# Altium project Flower.PrjPcb
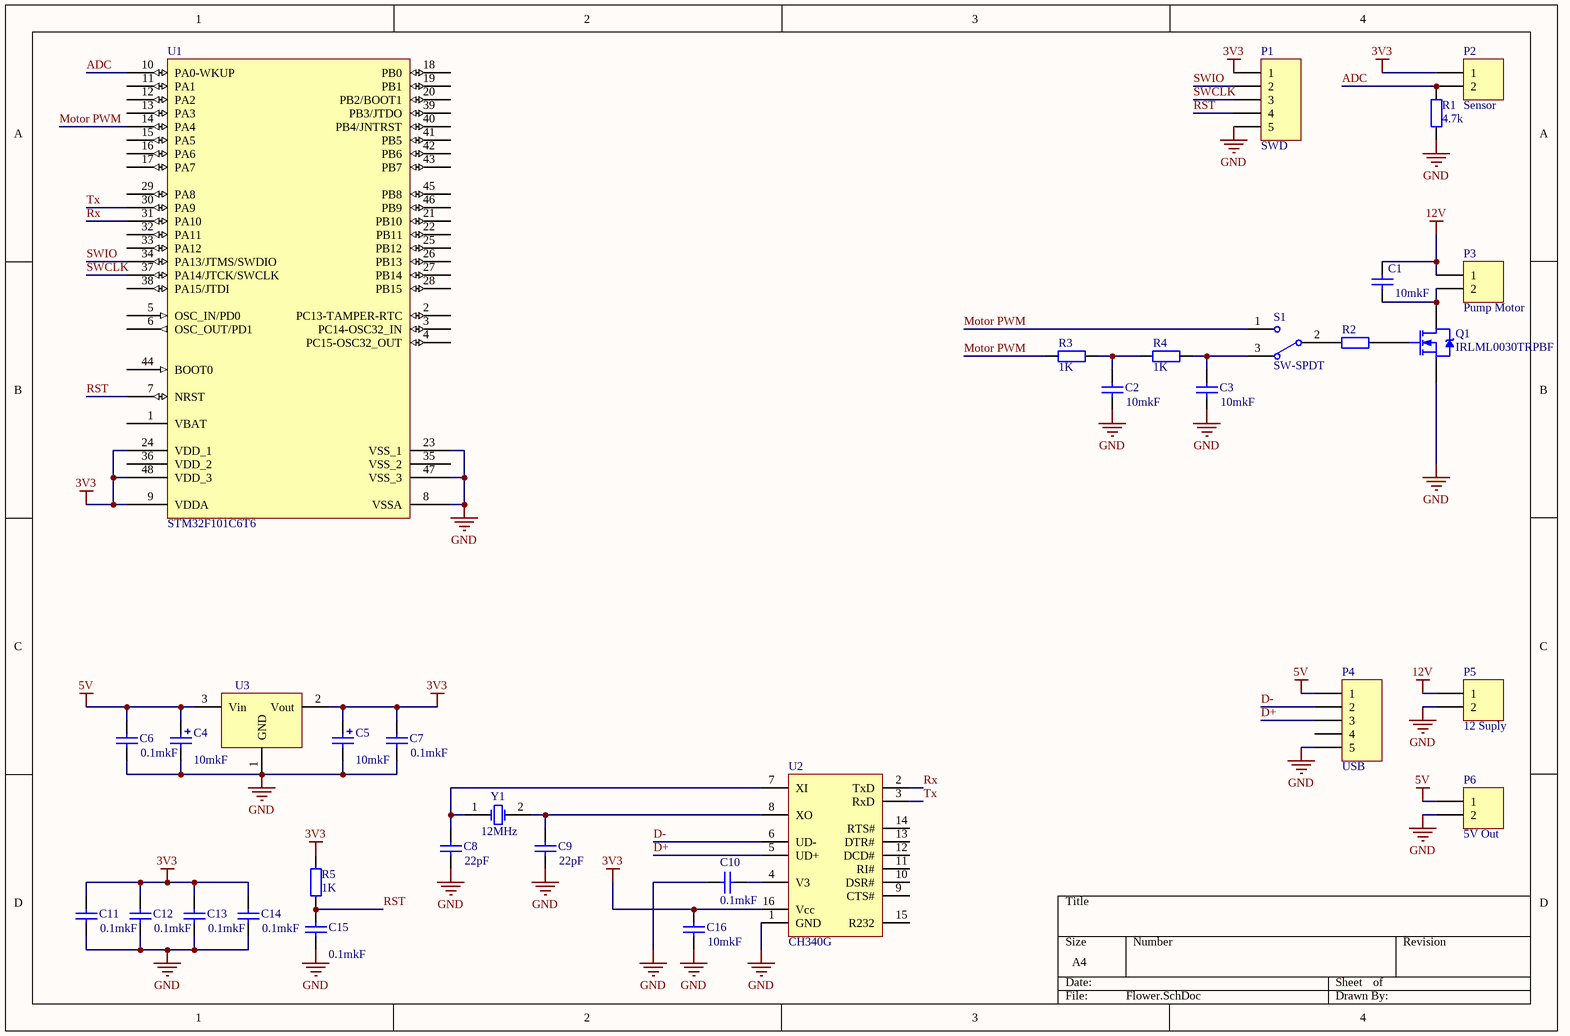
[diagram p0: Flower.SchDoc]
1 sheet, 33 parts. Net scope: global (net labels, ports and power ports of the same name join across sheets).
Board file: Flower.PcbDoc

## Sheet Flower.SchDoc
size A4

### Parts
C1  10mkF  [CAPC2012X135N]
C2  10mkF  [CAPC2012X135N]
C3  10mkF  [CAPC2012X135N]
C4  10mkF  [CAPC2012X135N]
C5  10mkF  [CAPC2012X135N]
C6  0.1mkF  [CAPC1608X90N]
C7  0.1mkF  [CAPC1608X90N]
C8  22pF  [CAPC1608X90N]
C9  22pF  [CAPC1608X90N]
C10  0.1mkF  [CAPC1608X90N]
C11  0.1mkF  [CAPC1608X90N]
C12  0.1mkF  [CAPC1608X90N]
C13  0.1mkF  [CAPC1608X90N]
C14  0.1mkF  [CAPC1608X90N]
C15  0.1mkF  [CAPC1608X90N]
C16  10mkF  [CAPC1608X90N]
P1  SWD  [HDR1X5]
P2  Sensor  [NXW-02SMDK]
P3  Pump Motor  [NXW-02SMDK]
P4  USB  [USB_Mini-B_Molex_SMT]
P5  12 Suply  [NXW-02SMD]
P6  5V Out  [NXW-02SMD]
Q1  IRLML0030TRPBF  [SOT23-3]
R1  4.7k  [RESC1608X55N]
R2  1K  [RESC1608X55N]  (value not drawn)
R3  1K  [RESC1608X55N]
R4  1K  [RESC1608X55N]
R5  1K  [RESC1608X55N]
S1  SW-SPDT  [HDR1X3]
U1  STM32F101C6T6  [LQFP48_N]
U2  CH340G  [SOIC127P600X175-16AN]
U3  LD1117  [SOT223]  (value not drawn)
Y1  value 12MHz  [KX-X 8MHz]  (hidden comment: XTAL)

### Nets
3V3: C5.1 C7.2 C11.2 C12.2 C13.2 C14.2 C16.2 P1.1 P2.1 R5.2 U1.9(VDDA) U1.24(VDD_1) U1.48(VDD_3) U2.16(Vcc) U3.2(Vout)
5V: C4.1 C6.2 P4.1 P6.1 U3.3(Vin)
12V: C1.2 P3.1 P5.1
GND: C2.1 C3.1 C4.2 C5.2 C6.1 C7.1 C8.1 C9.1 C10.2 C11.1 C12.1 C13.1 C14.1 C15.1 C16.1 P1.5 P4.5 P5.2 P6.2 Q1.3(S) R1.1 U1.8(VSSA) U1.23(VSS_1) U1.47(VSS_3) U2.1(GND) U3.1(GND)
ADC: P2.2 R1.2 U1.10(PA0-WKUP)
D+: P4.3 U2.5(UD+)
D-: P4.2 U2.6(UD-)
Motor PWM: R3.1 S1.1 U1.14(PA4)
RST: C15.2 P1.4 R5.1 U1.7(NRST)
Rx: U1.31(PA10) U2.2(TxD)
SWCLK: P1.3 U1.37(PA14/JTCK/SWCLK)
SWIO: P1.2 U1.34(PA13/JTMS/SWDIO)
Tx: U1.30(PA9) U2.3(RxD)
NetC1_1: C1.1 P3.2 Q1.2(D)
NetC2_2: C2.2 R3.2 R4.1
NetC3_2: C3.2 R4.2 S1.3
NetC8_2: C8.2 U2.7(XI) Y1.1(OSC1)
NetC9_2: C9.2 U2.8(XO) Y1.2(OSC2)
NetC10_1: C10.1 U2.4(V3)
NetQ1_1: Q1.1(G) R2.2
NetR2_1: R2.1 S1.2

Not connected (* = marked no-connect by the designer): P4 4; U1 1(VBAT) 2(PC13-TAMPER-RTC) 3(PC14-OSC32_IN) 4(PC15-OSC32_OUT) 5(OSC_IN/PD0) 6(OSC_OUT/PD1) 11(PA1) 12(PA2) 13(PA3) 15(PA5) 16(PA6) 17(PA7) 18(PB0) 19(PB1) 20(PB2/BOOT1) 21(PB10) 22(PB11) 25(PB12) 26(PB13) 27(PB14) 28(PB15) 29(PA8) 32(PA11) 33(PA12) 35(VSS_2) 36(VDD_2) 38(PA15/JTDI) 39(PB3/JTDO) 40(PB4/JNTRST) 41(PB5) 42(PB6) 43(PB7) 44(BOOT0) 45(PB8) 46(PB9); U2 9(CTS#) 10(DSR#) 11(RI#) 12(DCD#) 13(DTR#) 14(RTS#) 15(R232)

### Library data of the parts
C1-C3 C6-C16 = Cap Semi: Capacitor (Semiconductor SIM Model); Published: 8-Jun-2000; LatestRevisionDate: 29-May-2009; LatestRevisionNote: IPC-7351 Footprint Added.; PackageReference: C1206; Publisher: Altium Limited; PackageDescription: Chip Capacitor
  C1-C3 C16: Value: 10mkF
  C6 C7 C10-C15: Value: 0.1mkF
  C8 C9: Value: 22pF
C4 C5 = Cap Pol2: Polarized Capacitor (Axial); Published: 8-Jun-2000; LatestRevisionDate: 17-Jul-2002; LatestRevisionNote: Re-released for DXP Platform.; PackageReference: POLAR0.8; Publisher: Altium Limited; PackageDescription: Polarized Capacitor; 2 Leads; Value: 10mkF
P1 P4 = Header 5: Header, 5-Pin; LatestRevisionDate: 17-Jul-2002; LatestRevisionNote: Re-released for DXP Platform.; Publisher: Altium Limited
P2 P3 P5 P6 = Header 2: Header, 2-Pin; LatestRevisionDate: 17-Jul-2002; LatestRevisionNote: Re-released for DXP Platform.; Publisher: Altium Limited
Q1 = NMOS-2: N-Channel Power MOSFET; Note: Pin 2 is electrically connected to pin 4.; Published: 8-Jun-2000; LatestRevisionDate: 17-Jul-2002; LatestRevisionNote: Re-released for DXP Platform.; DatasheetVersion: PD-9.814; PackageVersion: Feb-1997; PackageReference: TO-220AB; Publisher: Altium Limited; PackageDescription: TO, Thru-Hole, Vertical, Heatsink Mounted; 3 In-Line Leads; Pitch 2.54 mm; ComponentLink1Description: Manufacturer Link; ComponentLink1URL: http://www.irf.com/
R1-R5 = Res2: Resistor; Published: 8-Jun-2000; LatestRevisionDate: 17-Jul-2002; LatestRevisionNote: Re-released for DXP Platform.; PackageReference: AXIAL-0.4; Publisher: Altium Limited; PackageDescription: Axial Device, Thru-Hole; 2 Leads; 0.4 in Pin Spacing
  R1: Value: 4.7k
  R2-R5: Value: 1K
S1 = SW-SPDT: SPDT Subminiature Toggle Switch, Right Angle Mounting, Vertical Actuation; Published: 24-Mar-1999; LatestRevisionDate: 17-Dec-2003; LatestRevisionNote: Schematic revised, PCB Footprint replaced.; DatasheetVersion: 05-Dec-2000; PackageReference: TL36WW15050; Publisher: Altium Limited; PackageDescription: Switch; 4 Leads; ComponentLink1Description: Manufacturer Link; ComponentLink1URL: http://www.apem.com
U1 = STM32F101C6T6: STM32 ARM-based 32-bit MCU with 32 Kbytes Flash, 48-pin LQFP, Industrial Temperature; Published: 30-May-2008; DatasheetVersion: rev6, Mar-2008; PackageVersion: Mar-2008; PackageReference: LQFP48; Publisher: Altium Limited; PackageDescription: 48-Pin Low-Profile Quad Flat Pack, 7 x 7 mm Body, 0.5 mm Pitch (LQFP48); ComponentLink1Description: Manufacturer Link; ComponentLink1URL: www.st.com/stm32; ComponentLink2Description: Datasheet; ComponentLink2URL: http://www.st.com/stonline/products/literature/ds/13586.pdf
Y1 = XTAL: Crystal Oscillator; Published: 8-Jun-2000; LatestRevisionDate: 17-Jul-2002; LatestRevisionNote: Re-released for DXP Platform.; PackageReference: R38; Publisher: Altium Limited; PackageDescription: Crystal, Thru-Hole; 2 Leads; Body 3.1 x 8.2 mm (Dia.xH)